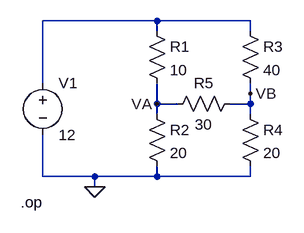
[diagram p0: schematic nodal9.asc]
nodal9.asc, the LTspice schematic file:
Version 4
SHEET 1 880 680
WIRE 176 32 0 32
WIRE 320 32 176 32
WIRE 176 48 176 32
WIRE 320 48 320 32
WIRE 0 128 0 32
WIRE 320 144 320 128
WIRE 176 160 176 128
WIRE 208 160 176 160
WIRE 320 160 320 144
WIRE 320 160 288 160
WIRE 176 176 176 160
WIRE 320 176 320 160
WIRE 0 272 0 208
WIRE 80 272 0 272
WIRE 176 272 176 256
WIRE 176 272 80 272
WIRE 320 272 320 256
WIRE 320 272 176 272
WIRE 80 288 80 272
FLAG 80 288 0
FLAG 176 160 VA
FLAG 320 144 VB
SYMBOL voltage 0 112 R0
WINDOW 123 0 0 Left 0
WINDOW 39 0 0 Left 0
SYMATTR InstName V1
SYMATTR Value 12
SYMBOL res 160 32 R0
SYMATTR InstName R1
SYMATTR Value 10
SYMBOL res 160 160 R0
SYMATTR InstName R2
SYMATTR Value 20
SYMBOL res 304 32 R0
SYMATTR InstName R3
SYMATTR Value 40
SYMBOL res 304 160 R0
SYMATTR InstName R4
SYMATTR Value 20
SYMBOL res 304 144 R90
WINDOW 0 0 56 VBottom 2
WINDOW 3 32 56 VTop 2
SYMATTR InstName R5
SYMATTR Value 30
TEXT -34 312 Left 2 !.op

The netlist it stands for:
* nodal9.asc
V1 N001 0 12
R1 N001 VA 10
R2 VA 0 20
R3 N001 VB 40
R4 VB 0 20
R5 VB VA 30
.op
.backanno
.end